# EAGLE design OneRCSchematic_v1_8 (EAGLE 8.2.2)
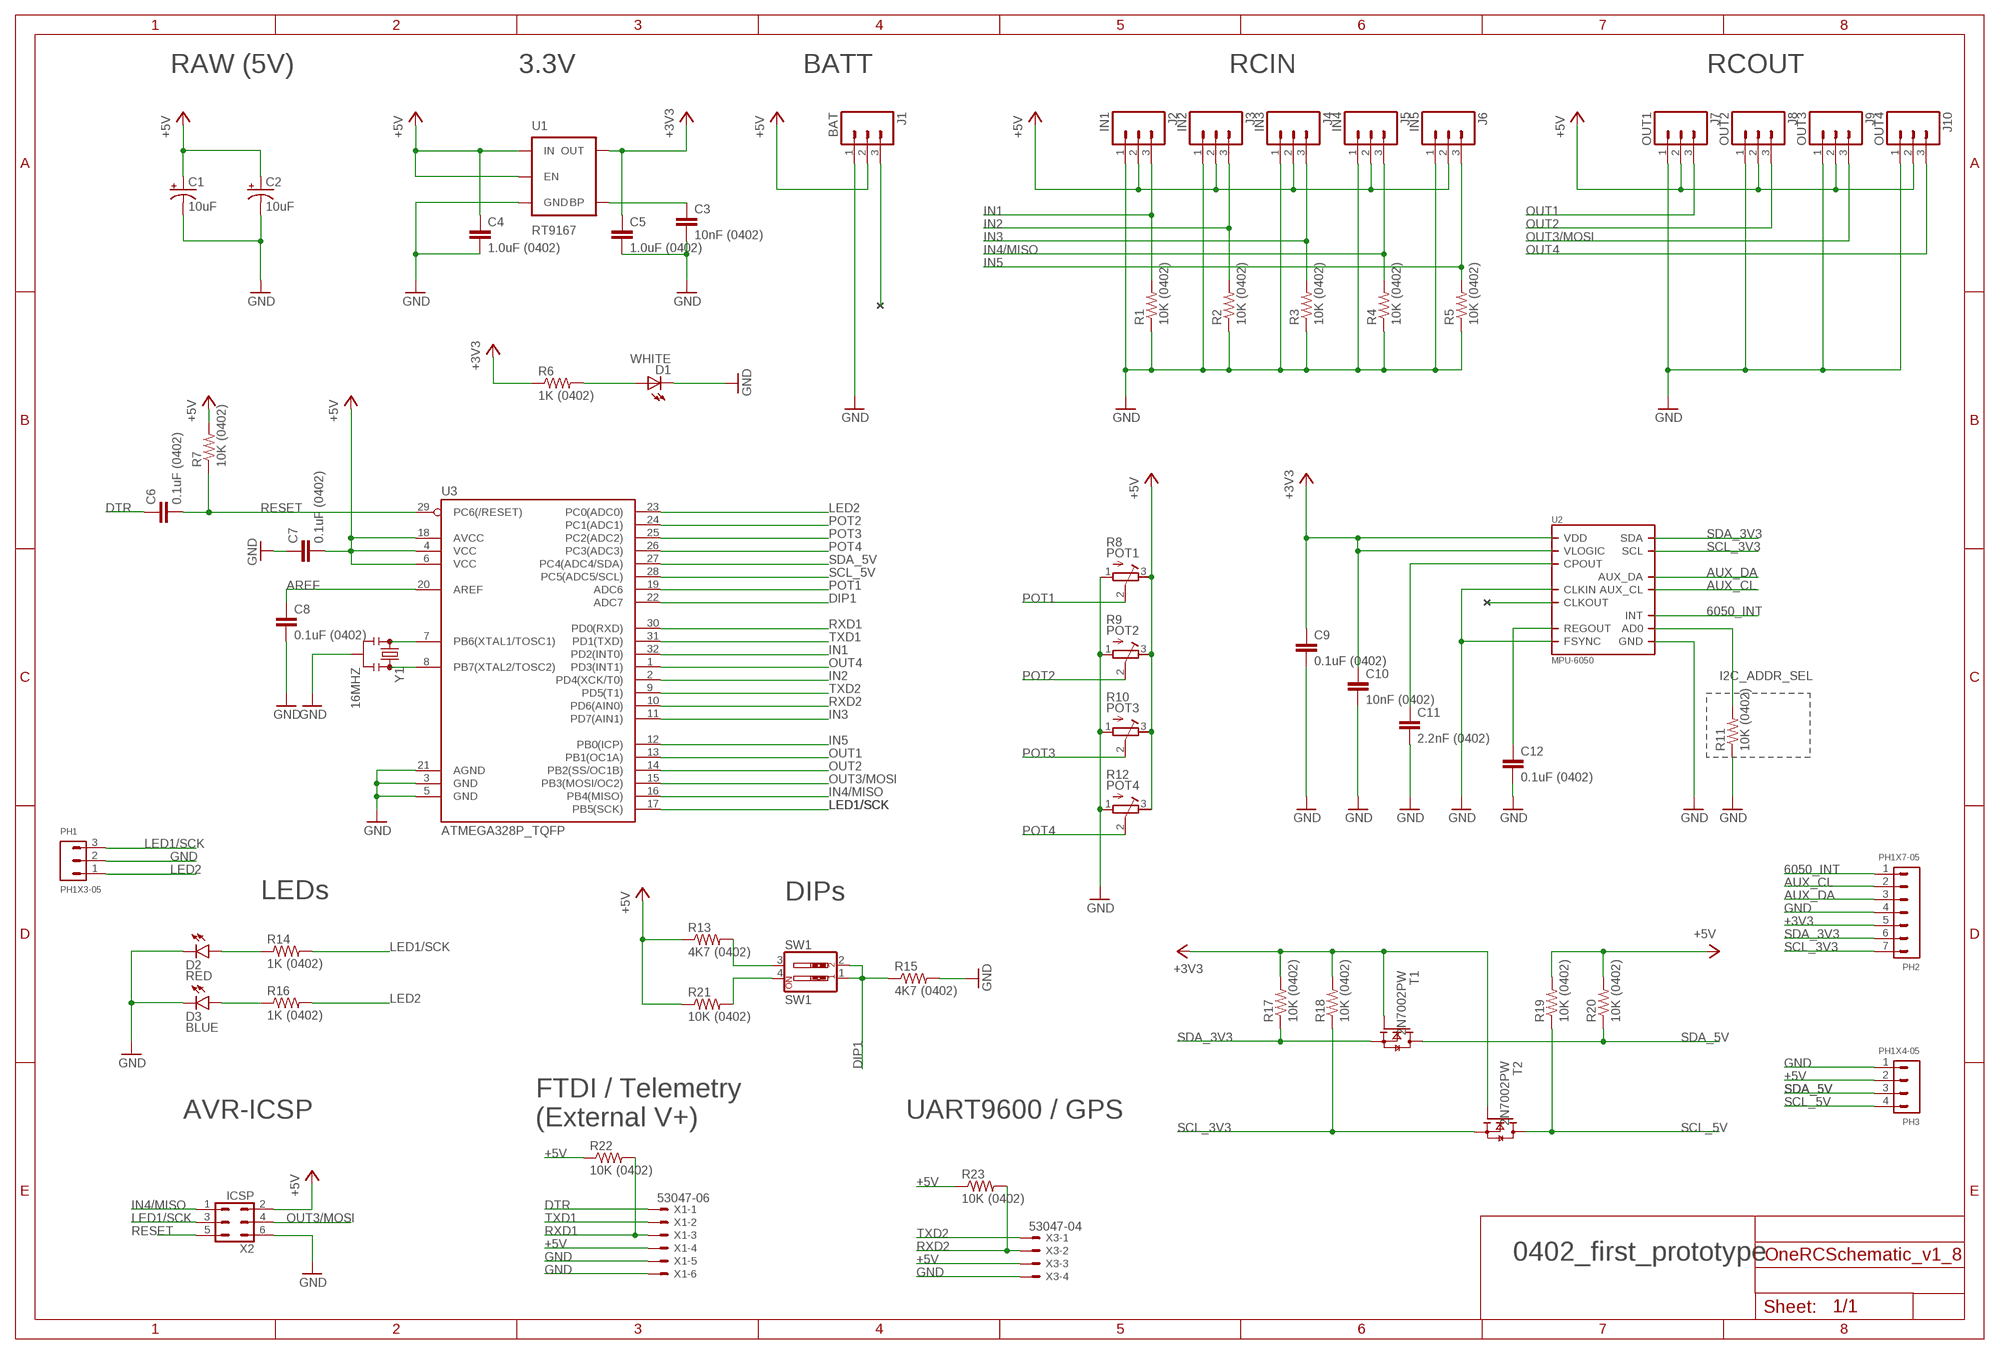
[diagram p0: schematic, sheet 1]

## Parts
C1  10uF  10UF-16V-10%(TANT)  [EIA3216]
C2  10uF  10UF-16V-10%(TANT)  [EIA3216]
C3  10nF (0402)  CAP0402-CAP  [0402-CAP]
C4  1.0uF (0402)  CAP0402-CAP  [0402-CAP]
C5  1.0uF (0402)  CAP0402-CAP  [0402-CAP]
C6  0.1uF (0402)  CAP0402-CAP  [0402-CAP]
C7  0.1uF (0402)  CAP0402-CAP  [0402-CAP]
C8  0.1uF (0402)  CAP0402-CAP  [0402-CAP]
C9  0.1uF (0402)  CAP0402-CAP  [0402-CAP]
C10  10nF (0402)  CAP0402-CAP  [0402-CAP]
C11  2.2nF (0402)  CAP0402-CAP  [0402-CAP]
C12  0.1uF (0402)  CAP0402-CAP  [0402-CAP]
D1  WHITE  LED-0402  [0402-LED]
D2  RED  LED-RED0603  [LED-0603]
D3  BLUE  LED-BLUE0603  [LED-0603]
J1  BAT  M03PTH  [1X03]
J2  IN1  M03PTH  [1X03]
J3  IN2  M03PTH  [1X03]
J4  IN3  M03PTH  [1X03]
J5  IN4  M03PTH  [1X03]
J6  IN5  M03PTH  [1X03]
J7  OUT1  M03PTH  [1X03]
J8  OUT2  M03PTH  [1X03]
J9  OUT3  M03PTH  [1X03]
J10  OUT4  M03PTH  [1X03]
PH1  PH1X3-05  [PH005-1-3]
PH2  PH1X7-05  [PH005-1-7]
PH3  PH1X4-05  [PH005-1-4]
R1  10K (0402)  RESISTOR0402  [0402-RES]
R2  10K (0402)  RESISTOR0402  [0402-RES]
R3  10K (0402)  RESISTOR0402  [0402-RES]
R4  10K (0402)  RESISTOR0402  [0402-RES]
R5  10K (0402)  RESISTOR0402  [0402-RES]
R6  1K (0402)  RESISTOR0402  [0402-RES]
R7  10K (0402)  RESISTOR0402  [0402-RES]
R8  POT1  R-TRIMM3202  [RTRIM3202]
R9  POT2  R-TRIMM3202  [RTRIM3202]
R10  POT3  R-TRIMM3202  [RTRIM3202]
R11  10K (0402)  RESISTOR0402  [0402-RES]
R12  POT4  R-TRIMM3202  [RTRIM3202]
R13  4K7 (0402)  RESISTOR0402  [0402-RES]
R14  1K (0402)  RESISTOR0402  [0402-RES]
R15  4K7 (0402)  RESISTOR0402  [0402-RES]
R16  1K (0402)  RESISTOR0402  [0402-RES]
R17  10K (0402)  RESISTOR0402  [0402-RES]
R18  10K (0402)  RESISTOR0402  [0402-RES]
R19  10K (0402)  RESISTOR0402  [0402-RES]
R20  10K (0402)  RESISTOR0402  [0402-RES]
R21  10K (0402)  RESISTOR0402  [0402-RES]
R22  10K (0402)  RESISTOR0402  [0402-RES]
R23  10K (0402)  RESISTOR0402  [0402-RES]
SW1  SW1  SW_DIP-2-SMT-HALFSIZE  [DIPSWITCH-02-50MIL]
T1  2N7002PW  [SOT323]
T2  2N7002PW  [SOT323]
U1  RT9167  MIC52053.3V  [SOT23-5]
U2  MPU-6050  [QFN.24.4X4]
U3  ATMEGA328P_TQFP  [TQFP32-08]
X1  53047-06  [53047-06]
X2  ICSP  PHB_1MM27_2X03_SNT  [PHB_1MM27_2X03_SNT]
X3  53047-04  [53047-04]
Y1  16MHZ  RESONATOR16MHZ  [RESONATOR-SMD]

## Nets
6050_INT: PH2.1 U2.12(INT)
+3V3: C5.1 C9.1 C10.1 PH2.5 R6.1 R17.2 R18.2 T1.1(G) T2.1(G) U1.5(OUT) U2.8(VLOGIC) U2.13(VDD)
+5V: C1.A(+) C2.A(+) C4.1 C7.2 J1.2 J2.2 J3.2 J4.2 J5.2 J6.2 J7.2 J8.2 J9.2 J10.2 PH3.2 R7.2 R8.3(E) R9.3(E) R10.3(E) R12.3(E) R13.1 R19.2 R20.2 R21.1 R22.1 R23.1 U1.1(IN) U1.3(EN) U3.4(VCC) U3.6(VCC) U3.18(AVCC) X1.4 X2.2 X3.3
AREF: C8.1 U3.20(AREF)
AUX_CL: PH2.2 U2.7(AUX_CL)
AUX_DA: PH2.3 U2.6(AUX_DA)
DIP1: R15.1 SW1.1 SW1.2 U3.22(ADC7)
DTR: C6.1 X1.1
GND: C1.C(-) C2.C(-) C3.2 C4.2 C5.2 C7.1 C8.2 C9.2 C10.2 C11.2 C12.2 D1.C D2.C D3.C J1.1 J2.1 J3.1 J4.1 J5.1 J6.1 J7.1 J8.1 J9.1 J10.1 PH1.2 PH2.4 PH3.1 R1.1 R2.1 R3.1 R4.1 R5.1 R8.1(A) R9.1(A) R10.1(A) R11.1 R12.1(A) R15.2 U1.2(GND) U2.1(CLKIN) U2.11(FSYNC) U2.18(GND) U3.3(GND) U3.5(GND) U3.21(AGND) X1.5 X1.6 X2.6 X3.4 Y1.2
IN1: J2.3 R1.2 U3.32(PD2(INT0))
IN2: J3.3 R2.2 U3.2(PD4(XCK/T0))
IN3: J4.3 R3.2 U3.11(PD7(AIN1))
IN4/MISO: J5.3 R4.2 U3.16(PB4(MISO)) X2.1
IN5: J6.3 R5.2 U3.12(PB0(ICP))
LED1/SCK: PH1.3 R14.2 U3.17(PB5(SCK)) X2.3
LED2: PH1.1 R16.2 U3.23(PC0(ADC0))
N$1: D2.A R14.1
N$2: U3.7(PB6(XTAL1/TOSC1)) Y1.1
N$3: U3.8(PB7(XTAL2/TOSC2)) Y1.3
N$4: J1.3
N$5: D3.A R16.1
N$6: D1.A R6.2
N$7: C3.1 U1.4(BP)
N$9: C11.1 U2.20(CPOUT)
N$10: C12.1 U2.10(REGOUT)
N$11: R13.2 SW1.3
N$12: R21.2 SW1.4
N$13: U2.22(CLKOUT)
N$15: R11.2 U2.9(AD0)
OUT1: J7.3 U3.13(PB1(OC1A))
OUT2: J8.3 U3.14(PB2(SS/OC1B))
OUT3/MOSI: J9.3 U3.15(PB3(MOSI/OC2)) X2.4
OUT4: J10.3 U3.1(PD3(INT1))
POT1: R8.2(S) U3.19(ADC6)
POT2: R9.2(S) U3.24(PC1(ADC1))
POT3: R10.2(S) U3.25(PC2(ADC2))
POT4: R12.2(S) U3.26(PC3(ADC3))
RESET: C6.2 R7.1 U3.29(PC6(/RESET)) X2.5
RXD1: R22.2 U3.30(PD0(RXD)) X1.3
RXD2: R23.2 U3.10(PD6(AIN0)) X3.2
SCL_3V3: PH2.7 R18.1 T2.2(S) U2.23(SCL)
SCL_5V: PH3.4 R19.1 T2.3(D) U3.28(PC5(ADC5/SCL))
SDA_3V3: PH2.6 R17.1 T1.2(S) U2.24(SDA)
SDA_5V: PH3.3 R20.1 T1.3(D) U3.27(PC4(ADC4/SDA))
TXD1: U3.31(PD1(TXD)) X1.2
TXD2: U3.9(PD5(T1)) X3.1

## Notes on the sheet
- RAW (5V) | 3.3V | BATT | RCIN | RCOUT
- I2C_ADDR_SEL
- LEDs | DIPs
- AVR-ICSP | UART9600 / GPS
- FTDI / Telemetry
  (External V+)
- 0402_first_prototype

## Library data of the parts
C1 C2 = SparkFun-Capacitors:10UF-16V-10%(TANT): CAP-00811 1206/EIA-3216 Tantalum capacitor; PROD_ID: CAP-00811
C3-C12 = SparkFun-Capacitors:CAP: Capacitor Standard 0603 ceramic capacitor, and 0.1" leaded capacitor.
D1 = pel_dipol_comp:LED
D2 = SparkFun-LED:LED-RED: Assorted Red LEDs LilyPad 1206- DIO-09912 1206- DIO-00809 0603- DIO-00819 "SMART" means more efficient and expensive; PROD_ID: DIO-00819
D3 = SparkFun-LED:LED-BLUE: Blue LEDs for production use Various blue LEDs stocked by SparkFun production 0603 - DIO-08575 Rebel - DIO-09553 1206 - DIO-09911; PROD_ID: DIO-08575
J1-J10 = SparkFun-Connectors:M03: Header 3 Standard 3-pin 0.1" header. Use with straight break away headers (SKU : PRT-00116), right angle break away headers (PRT-00553), swiss pins (PRT-00743), machine pins (PRT-00117), and female headers (PRT-00115). Molex polarized connector foot print use with SKU : PRT-08232 with associated crimp pins and housings.
PH1 = pel_hdr:PH1X3
PH2 = pel_hdr:PH1X7
PH3 = pel_hdr:PH1X4
R1-R7 R11 R13-R23 = SparkFun-Resistors:RESISTOR: Resistor Basic schematic elements and footprints for 0603, 1206, and PTH resistors.
R8-R10 R12 = resistor:R-TRIMM: Trimm resistor
SW1 = SparkFun-Electromechanical:SW_DIP-2: DIP SWITCH
T1 T2 = nxp_60:2N7002: N-channel TrenchMOS FET N-channel enhancement mode Field-Effect Transistor (FET) in a plastic package using TrenchMOS technology. AAL Eindhoven MK
U1 = SparkFun-PowerIC:MIC5205: MIC5205 150mA vreg 3.3V - VREG-00822 5V - VREG-00823; PROD_ID: VREG-00822
U2 = invensense:MPU-6050
U3 = SparkFun-DigitalIC:ATMEGA328P_TQFP; PROD_ID: IC-09069
X1 = con-molex:53?-06: CONNECTOR wire to board 1.25 mm (.049 inch) pitch header; MPN: 53047-0610-C; OC_FARNELL: 9733078; OC_NEWARK: 03M2965
X2 = _hhn_con_pinhead_box_1mm27_modify:PHB_1MM27_2X03_*: Pin Header Box-Type, 1.27mm/0.5"/50mil Pitch, 2x03 Circuits Note: see library description for an important note about THT-version
X3 = con-molex:53?-04: CONNECTOR wire to board 1.25 mm (.049 inch) pitch header; MF: WALDOM/MOLEX; MPN: 53047-0410; OC_FARNELL: 9733060; OC_NEWARK: 38C9900
Y1 = SparkFun-FreqCtrl:RESONATOR: Resonator Small SMD resonator. Used, eg, on the Arduino Pro/ Pro Mini boards. 8MHz- XTAL-08895 16MHz- XTAL-08900; PROD_ID: XTAL-08900

## Net classes
1 raw_1000mA_supply: width 1.016 mm

## Board
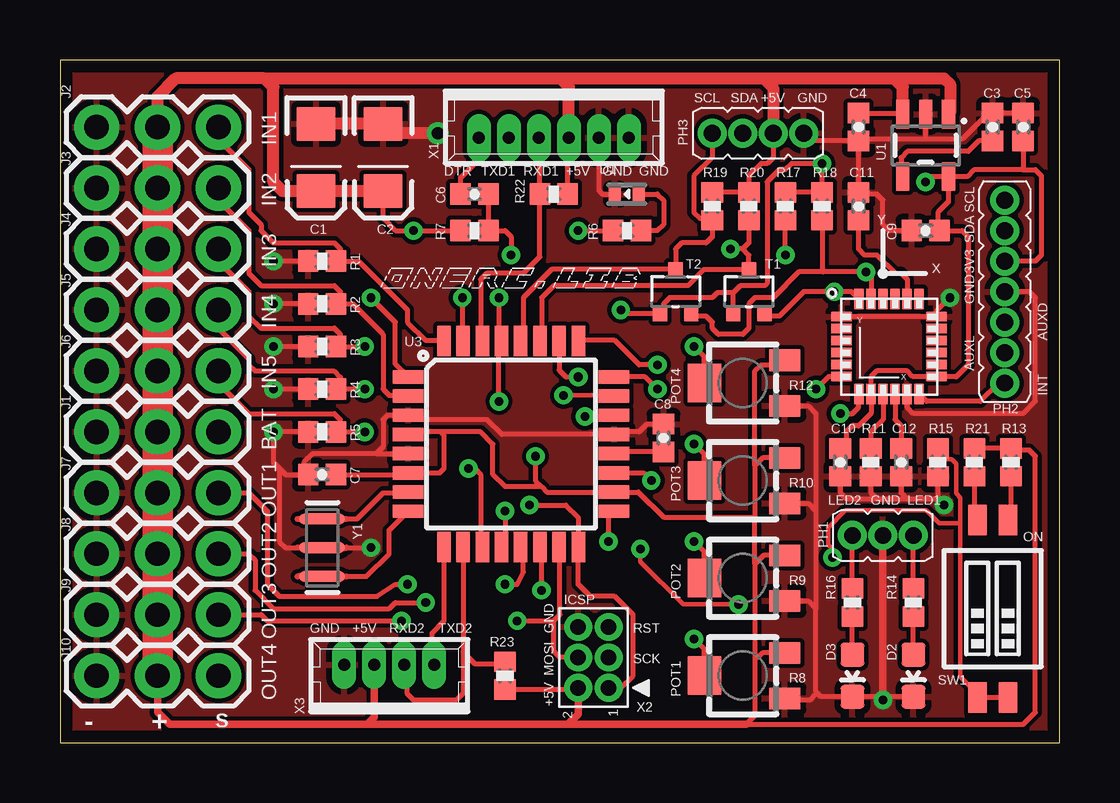
[diagram p1: board, top side]
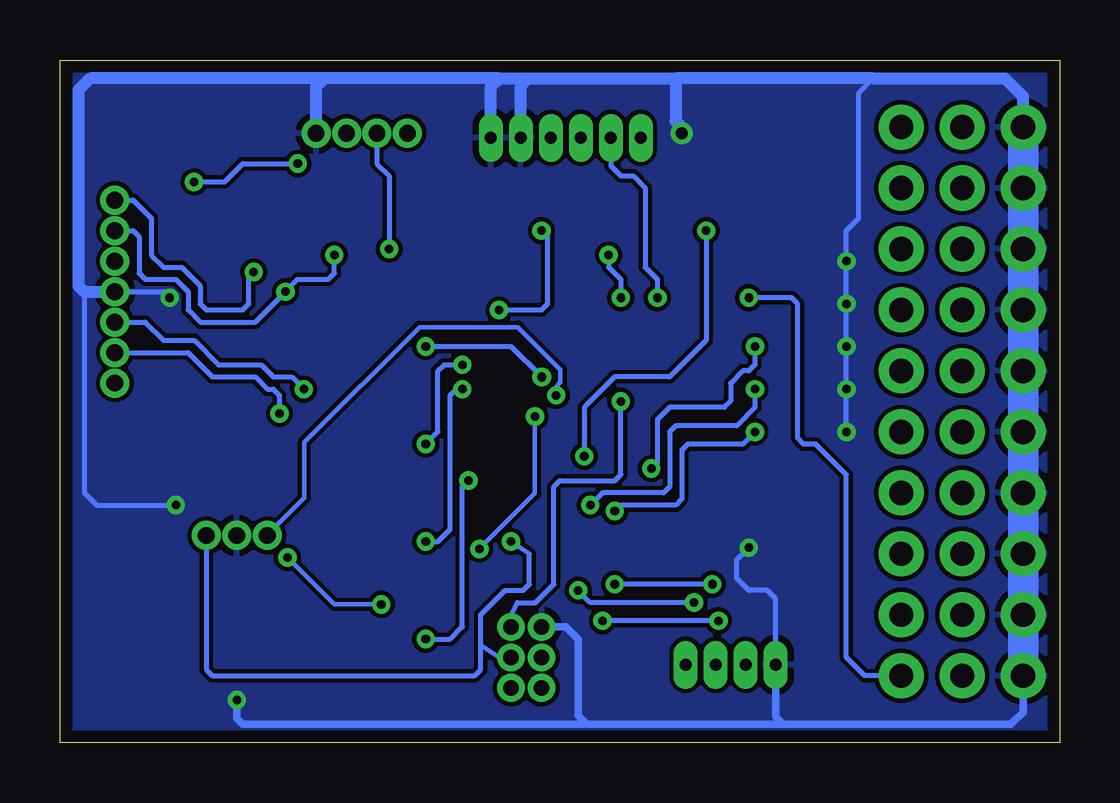
[diagram p2: board, bottom side, seen from below]

Size 41.66 x 28.45 mm. Coordinates in mm from the lower left corner, seen from the top.
Outline: 0,0 41.66,0 41.66,28.45 0,28.45 0,0
Copper layers (1*16): Top 0.035mm / dielectric 1.5mm / Bottom 0.035mm
Design rules "default *": minimum track width 7mil, minimum drill 14mil, track to track 7mil, track to pad 7mil, pad to pad 7mil, via to via 7mil, smd to smd 7mil, copper to edge 20mil, drill to drill 20mil, minimum pad ring 10mil, minimum via ring 8mil, stop-mask expansion 4mil, vias tented up to drill 0mil, thermal gap 10mil

### Footprints (pad centres in the part's own frame; a part is rotated, then mirrored left to right if it is on the bottom)
EIA3216 = smd 1.4 x 1.6: A 1.4,0; C -1.4,0
0402-CAP = smd 0.85 x 0.9: 1 -0.58,0; 2 0.58,0
0402-LED = smd 0.5 x 0.6: A 0.5,0; C -0.5,0
LED-0603 = smd 1 x 1: A 0,-0.877; C 0,0.877
1X03 = drill 1.016 pad 1.88: 1 0,0; 2 2.54,0; 3 5.08,0
PH005-1-3 = drill 0.7 pad 1.016: 1 0,0; 2 1.27,0; 3 2.54,0
PH005-1-7 = drill 0.7 pad 1.016: 1 0,0; 2 1.27,0; 3 2.54,0; 4 3.81,0; 5 5.08,0; 6 6.35,0; 7 7.62,0
PH005-1-4 = drill 0.7 pad 1.016: 1 0,0; 2 1.27,0; 3 2.54,0; 4 3.81,0
0402-RES = smd 0.85 x 0.9: 1 -0.58,0; 2 0.58,0
RTRIM3202 = smd 0.9 x 1.3: 1 -0.95,-1.75; 3 0.95,-1.75 | smd 1.6 x 1.4: 2 0,1.6
DIPSWITCH-02-50MIL = smd 0.762 x 1.27: 1 -0.635,-3.7; 2 0.635,-3.7; 3 0.635,3.7; 4 -0.635,3.7
SOT323 = smd 0.6 x 0.6: 1 -0.65,-0.925; 2 0.65,-0.925; 3 0,0.925
SOT23-5 = smd 0.55 x 1.2: 1 -0.95,-1.3; 2 0,-1.3; 3 0.95,-1.3; 4 0.95,1.3; 5 -0.95,1.3
QFN.24.4X4 = smd 0.85 x 0.38: 1 -1.975,1.25; 2 -1.975,0.75; 3 -1.975,0.25; 4 -1.975,-0.25; 5 -1.975,-0.75; 6 -1.975,-1.25; 13 1.975,-1.25; 14 1.975,-0.75; 15 1.975,-0.25; 16 1.975,0.25; 17 1.975,0.75; 18 1.975,1.25 | smd 0.38 x 0.85: 7 -1.25,-1.975; 8 -0.75,-1.975; 9 -0.25,-1.975; 10 0.25,-1.975; 11 0.75,-1.975; 12 1.25,-1.975; 19 1.25,1.975; 20 0.75,1.975; 21 0.25,1.975; 22 -0.25,1.975; 23 -0.75,1.975; 24 -1.25,1.975
TQFP32-08 = smd 1.27 x 0.559: 1 -4.293,2.8; 2 -4.293,2; 3 -4.293,1.2; 4 -4.293,0.4; 5 -4.293,-0.4; 6 -4.293,-1.2; 7 -4.293,-2; 8 -4.293,-2.8; 17 4.293,-2.8; 18 4.293,-2; 19 4.293,-1.2; 20 4.293,-0.4; 21 4.293,0.4; 22 4.293,1.2; 23 4.293,2; 24 4.293,2.8 | smd 0.559 x 1.27: 9 -2.8,-4.293; 10 -2,-4.293; 11 -1.2,-4.293; 12 -0.4,-4.293; 13 0.4,-4.293; 14 1.2,-4.293; 15 2,-4.293; 16 2.8,-4.293; 25 2.8,4.293; 26 2,4.293; 27 1.2,4.293; 28 0.4,4.293; 29 -0.4,4.293; 30 -1.2,4.293; 31 -2,4.293; 32 -2.8,4.293
53047-06 = drill 0.5 pad 0.698 long: 1 3.125,0.45; 2 1.875,0.45; 3 0.625,0.45; 4 -0.625,0.45; 5 -1.875,0.45; 6 -3.125,0.45
PHB_1MM27_2X03_SNT = drill 0.65: 1 -1.27,-0.635; 2 -1.27,0.635; 3 0,-0.635; 4 0,0.635; 5 1.27,-0.635; 6 1.27,0.635
53047-04 = drill 0.5 pad 0.698 long: 1 1.875,0.45; 2 0.625,0.45; 3 -0.625,0.45; 4 -1.875,0.45
RESONATOR-SMD = smd 0.45 x 1.905: 1 -1.2,0; 2 0,0; 3 1.2,0

### Placement (x,y rotation side)
C1  10.67,24.38 270 top
C2  13.46,24.38 270 top
C3  38.86,25.65 90 top
C4  33.27,25.65 270 top
C5  40.13,25.65 90 top
C6  17.27,22.86 0 top
C7  10.92,11.18 0 top
C8  25.15,12.7 90 top
C9  36.07,21.34 180 top
C10  32.51,11.68 270 top
C11  33.27,22.35 90 top
C12  35.05,11.68 270 top
D1  23.62,22.86 0 top
D2  35.56,2.79 180 top
D3  33.02,2.79 180 top
J1  1.52,12.95 0 top
J2  1.52,25.65 0 top
J3  1.52,23.11 0 top
J4  1.52,20.57 0 top
J5  1.52,18.03 0 top
J6  1.52,15.49 0 top
J7  1.52,10.41 0 top
J8  1.52,7.87 0 top
J9  1.52,5.33 0 top
J10  1.52,2.79 0 top
PH1  33.02,8.64 0 top
PH2  39.37,14.99 90 top
PH3  30.99,25.4 180 top
R1  10.92,20.07 0 top
R2  10.92,18.29 0 top
R3  10.92,16.51 0 top
R4  10.92,14.73 0 top
R5  10.92,12.95 0 top
R6  23.62,21.34 0 top
R7  17.27,21.34 180 top
R8  28.45,2.79 90 top
R9  28.45,6.86 90 top
R10  28.45,10.92 90 top
R11  33.78,11.68 90 top
R12  28.45,14.99 90 top
R13  39.62,11.68 270 top
R14  35.56,5.84 90 top
R15  36.58,11.68 270 top
R16  33.02,5.84 90 top
R17  30.23,22.35 90 top
R18  31.75,22.35 90 top
R19  27.18,22.35 90 top
R20  28.7,22.35 90 top
R21  38.1,11.68 270 top
R22  20.57,22.86 180 top
R23  18.54,2.79 90 top
SW1  38.86,5.59 0 top
T1  28.7,18.8 0 top
T2  25.65,18.8 0 top
U1  36.07,24.89 180 top
U2  34.54,16.51 0 top
U3  18.8,12.45 0 top
U$2  [ONE_RX_LOG_TINY_TOP]  13.21,18.8 0 top
X1  20.57,25.65 180 top
X2  22.23,3.56 90 top
X3  13.72,2.79 0 top
Y1  10.92,8.13 270 top

### Tracks (layer width: path | path; a pad name or v marks a point on that pad's centre or on a via)
6050_INT
  Top 0.203: PH2.1 39.12,14.99 38.35,14.22 36.1,14.22 U2.12
+3V3  (via drill 0.36 pad 0.51)
  Top 0.203: 28.21,18.03 T1.1 28.05,18.76 | 28.05,18.76 28.34,19.05 29.38,19.05 29.46,19.14 29.46,23.37 29.97,23.88 30.23,23.88 30.48,24.13 v31.75,24.13 R18.2 R17.2 | U1.5 37.82,23.59 38.1,23.88 40.1,23.88 | 40.1,23.88 40.64,23.88 40.89,23.62 40.89,20.32 40.64,20.07 PH2.5 | U1.5 36.29,23.59 v36.07,23.37 | C5.1 40.13,23.91 40.1,23.88 | v23.37,18.03 23.53,17.87 T2.1 25.15,18.01 25.15,18.29 25.4,18.54 27.18,18.54 27.39,18.76 28.05,18.76 | v21.59,21.34 R6.1 | U1.5 37.02,22.54 36.58,22.1 36.58,21.41 C9.1 37.59,21.34 37.85,21.08 37.85,15.75 37.34,15.24 36.54,15.24 U2.13 35.54,15.26 35.31,15.49 34.04,15.49 33.78,15.24 33.78,14.55 U2.8 33.79,13.73 33.27,13.21 33.02,13.21 32.77,12.95 32.77,12.52 C10.1
  Bottom 0.203: v23.37,18.03 21.59,18.03 21.34,18.29 21.34,21.08 v21.59,21.34 | v36.07,23.37 34.8,23.37 34.04,24.13 v31.75,24.13
+5V  (via drill 0.36 pad 0.51)
  Top 0.203: C7.2 14.43,11.18 U3.6 15.82,11.25 16,11.43 16,12.81 15.86,12.95 | R23.1 21.52,2.21 X2.2 | U3.4 14.61,12.95 15.86,12.95 | 39.41,12.26 R13.1 | 39.41,12.26 R21.1 | R19.2 R20.2 28.7,23.62 29.21,24.13 29.46,24.13 29.72,24.38 PH3.2 | 20.07,10.67 20.29,10.45 U3.18 24.1,10.45 25.15,9.4 28.91,9.4 28.96,9.35 | 20.07,10.67 18.54,10.67 18.03,11.18 18.03,12.45 17.53,12.95 15.86,12.95 | 28.96,3.43 28.96,1.12 28.6,0.76 40.13,0.76 40.64,1.27 40.64,11.94 40.39,12.19 39.48,12.19 39.41,12.26 | 28.96,7.45 28.96,3.43 | 28.96,7.45 28.96,9.35 | 30.13,7.62 R9.3 29.32,7.81 28.96,7.45 | 30.13,11.68 R10.3 29.28,11.87 28.96,11.55 | 28.96,11.55 28.96,9.35 | 28.96,11.55 28.96,15.49 29.21,15.75 30.13,15.75 R12.3 | C2.A 13.46,21.84 13.97,21.34 v14.73,21.34 R7.2 | v19.81,11.94 19.81,10.92 20.07,10.67 | C4.1 35.03,26.23 35.12,26.32 | R8.3 29.27,3.74 28.96,3.43 | R22.1 21.15,25.41 X1.4
  Top 0.305: 4.06,2.67 J10.2 4.06,1.27 4.57,0.76 12.79,0.76 | 12.79,0.76 21.16,0.76 | 21.16,0.76 28.6,0.76 | X2.2 21.59,1.19 21.16,0.76 | X3.3 13.09,1.06 12.79,0.76
  Top 0.508: J2.2 4.06,26.92 4.83,27.69 8.52,27.69 | 29.32,27.69 34.75,27.69 | 20.84,27.69 29.32,27.69 | 8.52,27.69 20.84,27.69 | 34.75,27.69 36.83,27.69 37.08,27.43 37.08,26.26 U1.1 | U1.3 35.12,26.32 35.12,27.32 34.75,27.69 | PH3.2 29.72,27.29 29.32,27.69 | X1.4 21.2,27.33 20.84,27.69 | 8.52,27.69 8.89,27.31 8.89,23.37 9.27,22.98 C1.A C2.A
  Top 1.27: J2.2 J3.2 J4.2 J5.2 J6.2 J1.2 J7.2 J8.2 J9.2 4.06,2.67
  Bottom 0.203: v14.73,21.34 14.73,16.76 16.26,15.24 18.54,15.24 19.81,13.97 v19.81,11.94
AREF
  Top 0.203: C8.1 23.16,12.12 U3.20
AUX_CL  (via drill 0.36 pad 0.51)
  Top 0.203: U2.7 33.27,14.51 33.27,13.97 33.02,13.72 v32.51,13.72
  Bottom 0.203: PH2.2 36.32,16.26 35.31,15.24 33.53,15.24 33.02,14.73 32.77,14.73 32.51,14.48 v32.51,13.72
AUX_DA  (via drill 0.36 pad 0.51)
  Top 0.203: U2.6 32.02,15.26 v31.5,14.73
  Bottom 0.203: PH2.3 38.1,17.53 37.34,16.76 36.07,16.76 35.05,15.75 33.27,15.75 32.77,15.24 32,15.24 v31.5,14.73
DIP1  (via drill 0.36)
  Top 0.178: 37.52,9.14 37.52,2.74 38.23,2.03 SW1.1 | 37.52,9.14 37.52,10.21 37.34,10.39 37.34,11.63 37.16,11.81 36.98,11.81 36.63,12.17 R15.1 | v21.87,13.59 22.94,13.59 U3.22 | v24.18,8.08 24.18,7.54 25.96,5.77 v28.27,5.77 | v32.18,7.72 32.18,8.08 32,8.25 32,8.97 32.72,9.68 36.09,9.68 36.63,9.14 37.52,9.14
  Top 0.203: SW1.1 SW1.2
  Bottom 0.178: v21.87,13.59 21.87,10.39 v24.18,8.08 | v28.27,5.77 30.23,5.77 v32.18,7.72
DTR
  Top 0.203: C6.1 16.69,23.55 17.27,24.13 17.27,25.03 X1.1
GND  (via drill 0.36 pad 0.51, 0.36 pad 0.56, 0.51 pad 0.81)
  Top 0.203: 13.18,12.05 U3.5 | 13.18,12.05 10.52,12.05 10.16,11.68 10.16,11.36 C7.1 9.4,11.18 9.14,11.43 | 13.18,12.05 13.46,12.33 13.46,13.46 13.65,13.65 U3.3 14.69,13.46 17.78,13.46 18.4,12.85 U3.21 23.2,12.95 24.13,12.95 24.46,13.28 C8.2 | C5.2 C3.2 38.68,26.23 37.59,25.15 36.07,25.15 | U2.18 36.54,17.78 | 33.27,25 33.2,25.07 | v37.08,18.54 36.52,17.98 U2.18 | U2.18 U2.1 | 30.67,5.65 R9.1 31.18,5.91 31.5,5.59 | 35.67,2.03 D2.C 34.43,1.92 v34.29,1.78 34.15,1.92 D3.C 31.7,1.92 31.5,2.12 | U2.11 35.31,14.52 35.31,13.97 35.56,13.72 40.13,13.72 40.64,14.22 40.64,18.54 40.39,18.8 PH2.4 | 36.83,10.85 R15.2 36.58,10.16 | v12.95,8.13 Y1.2 9.4,8.13 9.14,8.38 9.14,11.43 | R10.1 31.18,9.97 31.5,9.65 | 31.5,9.65 31.5,5.59 | R12.1 31.18,14.04 31.5,13.72 31.5,9.65 | R8.1 30.26,1.78 31.24,1.78 31.5,2.03 31.5,2.12 | 33.27,25 C11.2 33.35,22.86 34.04,22.86 34.29,22.61 34.29,21.59 34.54,21.34 C9.2 | C4.2 33.35,25.15 36.07,25.15 | 36.07,25.15 U1.2 | C4.2 31.31,25.07 PH3.1 | R1.1 v8.89,20.07 | R2.1 v8.89,18.29 | R3.1 v8.89,16.51 | R4.1 v8.89,14.73 | R5.1 v8.89,12.95 8.89,11.68 9.14,11.43 | 31.5,2.12 31.5,5.59 | C4.2 33.27,25 | C12.2 35.05,10.41 35.31,10.16 | 35.31,10.16 36.58,10.16 | 36.58,10.16 v36.83,9.91 | R11.1 33.78,10.41 34.04,10.16 | 34.04,10.16 35.31,10.16 | C10.2 32.51,10.41 32.77,10.16 34.04,10.16 | X1.5 22.45,23.02 22.61,22.86 D1.C
  Top 0.305: v34.29,1.78 PH1.2
  Top 0.508: C1.C C2.C 13.85,25.4 v15.75,25.4
  Bottom 0.203: 11.94,3.15 X3.4 11.84,6 12.19,6.35 12.95,6.35 13.46,6.86 13.46,7.62 v12.95,8.13 | PH2.4 37.34,18.8 v37.08,18.54 | v36.83,9.91 40.13,9.91 40.64,10.41 40.64,18.74 40.58,18.8 | v8.89,12.95 v8.89,14.73 v8.89,16.51 v8.89,18.29 v8.89,20.07 8.89,21.34 8.38,21.84 8.38,27.07 7.77,27.69
  Bottom 0.305: J10.1 1.52,1.27 2.03,0.76 11.53,0.76 | 11.53,0.76 19.71,0.76 | 19.71,0.76 34.04,0.76 34.29,1.02 v34.29,1.78 | X2.6 20.57,4.83 20.07,4.32 20.07,1.12 19.71,0.76 | X3.4 11.84,1.08 11.53,0.76
  Bottom 0.508: J2.1 1.52,26.92 2.29,27.69 7.77,27.69 16,27.69 | 23.36,27.69 22.14,27.69 | 23.36,27.69 30.63,27.69 | 22.14,27.69 16,27.69 | 30.63,27.69 40.39,27.69 40.89,27.18 40.89,19.05 40.64,18.8 40.58,18.8 PH2.4 | PH3.1 30.99,27.33 30.63,27.69 | X1.5 22.45,27.37 22.14,27.69 | X1.6 23.7,27.35 23.36,27.69 | 16,27.69 16,25.91 15.75,25.65 v15.75,25.4
  Bottom 1.27: J2.1 J3.1 J4.1 J5.1 J6.1 J1.1 J7.1 J8.1 J9.1 J10.1
  pour Bottom: 0,28.45 41.66,28.45 41.66,0 0,0
  pour Top: 0,28.45 0,0 41.66,0 41.66,28.45
IN1
  Top 0.203: J2.3 6.6,25.15 7.87,23.88 7.87,22.1 8.38,21.59 8.38,21.34 8.89,20.83 11.43,20.83 11.68,20.57 11.68,20.07 11.69,20.07 R1.2 12.45,20.07 14.48,18.03 14.48,17.53 15.24,16.76 15.97,16.76 U3.32
IN2
  Top 0.203: J3.3 6.6,22.61 7.87,21.34 7.87,19.56 8.38,19.05 11.43,19.05 11.68,18.8 11.68,18.32 11.71,18.29 | U3.2 14.47,14.48 13.72,14.48 13.46,14.73 13.46,17.02 12.19,18.29 11.71,18.29 | 11.71,18.29 R2.2
IN3  (via drill 0.36 pad 0.51)
  Top 0.203: J4.3 6.6,20.07 7.87,18.8 7.87,17.78 8.38,17.27 11.43,17.27 11.68,17.02 11.68,16.54 | 11.68,16.54 11.68,16.52 | U3.11 17.53,8.22 17.53,11.18 17.27,11.43 v17.02,11.43 | 11.71,16.51 v12.7,16.51 | 11.71,16.51 11.68,16.54 | R3.2 11.71,16.51
  Bottom 0.203: v12.7,16.51 12.7,15.75 12.95,15.49 13.21,15.49 13.72,14.99 13.72,14.22 13.97,13.97 16.26,13.97 16.76,13.46 16.76,11.68 v17.02,11.43
IN4/MISO  (via drill 0.36 pad 0.51)
  Top 0.203: U3.16 | 11.68,15.24 11.68,15.21 | 11.68,15.21 11.4,15.49 8.13,15.49 7.87,15.75 7.87,16 6.6,17.27 J5.3 | v19.56,9.91 21.08,9.91 21.59,9.4 U3.16 | X2.1 23.37,2.29 23.88,2.79 23.88,5.33 23.11,6.1 22.1,6.1 21.59,6.6 U3.16 | 11.68,15.21 11.68,14.91 R4.2 v12.7,14.73
  Bottom 0.203: v12.7,14.73 12.7,13.97 13.46,13.21 16,13.21 16.26,12.95 16.26,10.67 16.51,10.41 19.05,10.41 v19.56,9.91
IN5  (via drill 0.36 pad 0.51)
  Top 0.203: 11.6,12.95 v12.7,12.95 | J6.3 6.6,14.99 7.87,13.72 11.43,13.72 11.68,13.46 11.68,13.04 11.6,12.95 | U3.12 18.29,8.26 18.54,8.51 v18.54,9.65 | R5.2 11.6,12.95
  Bottom 0.203: v12.7,12.95 13.21,12.45 15.49,12.45 15.75,12.19 15.75,10.16 16,9.91 18.29,9.91 v18.54,9.65
LED1/SCK  (via drill 0.36 pad 0.51)
  Top 0.203: v22.86,8.38 22.86,9.42 U3.17 | R14.2 PH1.3
  Bottom 0.203: X2.3 23.37,3.56 24.13,4.06 | 24.13,4.06 24.13,5.33 23.11,6.35 22.35,6.35 22.1,6.6 22.1,7.87 v22.86,8.38 | PH1.3 35.56,3.05 35.31,2.79 24.38,2.79 24.13,3.05 24.13,4.06
LED2  (via drill 0.36)
  Top 0.178: 22.94,14.3 U3.23 22.94,14.48 v20.98,14.48
  Top 0.203: R16.2 PH1.1
  Bottom 0.178: v20.98,14.48 20.98,14.83 20.8,15.01 20.8,15.54 22.58,17.32 26.67,17.32 31.47,12.52 31.47,10.21 32.89,8.79 PH1.1
N$1
  Top 0.203: D2.A R14.1
N$2
  Top 0.203: Y1.1 12.38,9.33 13.46,10.41 14.47,10.41 U3.7
N$3
  Top 0.203: Y1.3 12.77,6.93 13.72,7.87 13.72,8.86 U3.8
N$5
  Top 0.203: D3.A R16.1
N$6
  Top 0.203: D1.A 24.89,22.86 25.15,22.61 25.15,21.59 24.89,21.34 R6.2
N$7
  Top 0.203: C3.1 38.28,25.07 37.85,24.64 35.31,24.64 35.05,24.38 35.05,23.66 U1.4
N$9
  Top 0.203: C11.1 33.27,20.57 33.53,20.32 34.04,20.32 34.8,19.56 35.05,19.56 35.31,19.3 35.31,18.5 U2.20
N$10
  Top 0.203: U2.10 34.79,13.47 35.05,13.21 C12.1
N$11
  Top 0.203: R13.2 39.62,9.41 SW1.3
N$12
  Top 0.203: R21.2 38.1,9.41 SW1.4
N$15
  Top 0.203: U2.9 34.29,13.47 33.78,12.95 R11.2
OUT1  (via drill 0.36 pad 0.51)
  Top 0.203: J7.3 7.87,10.41 8.64,9.65 8.64,6.6 9.14,6.1 13.21,6.1 13.97,6.6 v14.48,6.6 | v18.54,6.6 19.05,6.6 19.3,7.11 19.3,8.04 U3.13
  Bottom 0.203: v14.48,6.6 v18.54,6.6
OUT2  (via drill 0.36 pad 0.51)
  Top 0.203: J8.3 7.87,7.87 8.13,7.62 8.13,6.35 8.89,5.59 13.72,5.59 13.97,5.84 v15.24,5.84 | v20.07,6.35 20.07,8.08 U3.14
  Bottom 0.203: v15.24,5.84 19.56,5.84 v20.07,6.35
OUT3/MOSI  (via drill 0.36 pad 0.51)
  Top 0.203: X2.4 20.83,3.56 20.57,3.81 20.57,5.08 | U3.15 20.83,8.12 20.83,5.33 20.57,5.08 | J9.3 8.38,5.33 8.64,5.08 v14.22,5.08 | v19.05,5.08 20.57,5.08
  Bottom 0.203: v14.22,5.08 v19.05,5.08
OUT4  (via drill 0.36 pad 0.51)
  Top 0.203: U3.1 13.97,15.78 13.97,17.53 v12.95,18.54
  Bottom 0.203: J10.3 8.13,2.79 8.89,3.56 8.89,11.18 10.16,12.45 10.67,12.45 10.92,12.7 10.92,18.29 11.18,18.54 v12.95,18.54
POT1  (via drill 0.36 pad 0.51)
  Top 0.203: R8.2 26.85,3.89 v26.42,4.32 | U3.19 24.31,11.25 v24.64,10.92
  Bottom 0.203: v26.42,4.32 25.4,4.32 24.89,4.83 24.89,10.67 v24.64,10.92
POT2  (via drill 0.36 pad 0.51)
  Top 0.203: R9.2 26.85,7.95 v26.42,8.38 | v24.89,14.73 24.38,15.24 U3.24
  Bottom 0.203: v26.42,8.38 25.91,8.38 25.4,8.89 25.4,14.48 25.15,14.73 v24.89,14.73
POT3  (via drill 0.36 pad 0.51)
  Top 0.203: R10.2 26.85,12.01 v26.42,12.45 | U3.25 21.62,16.76 23.11,16.76 24.13,15.75 v24.89,15.75
  Bottom 0.203: v26.42,12.45 25.91,12.95 25.91,15.49 25.65,15.75 v24.89,15.75
POT4  (via drill 0.36 pad 0.51, 0.38 pad 0.64)
  Top 0.203: R12.2 26.85,16.08 v26.42,16.51 | 20.83,16.71 U3.26 20.8,15.53 21.08,15.24 v21.59,15.24
  Bottom 0.203: v26.42,16.51 22.86,16.51 v21.59,15.24
RESET  (via drill 0.36 pad 0.51)
  Top 0.203: v18.29,14.22 18.29,16.63 U3.29 18.29,16.85 v18.29,18.54 | C6.2 R7.1 18.54,21.34 18.8,21.08 v18.8,20.32
  Bottom 0.203: X2.5 22.86,5.33 22.61,5.84 21.84,5.84 21.08,6.6 21.08,10.67 20.83,10.92 18.54,10.92 18.29,11.18 v18.29,14.22 | v18.8,20.32 18.8,19.81 18.29,19.3 v18.29,18.54
RXD1
  Top 0.203: U3.30 17.53,16.81 17.53,19.3 17.78,19.56 19.3,19.56 19.99,20.25 R22.2 19.99,25.16 X1.3
RXD2
  Top 0.203: U3.10 16.8,3.78 | 16.8,3.78 17.27,3.3 18.47,3.3 R23.2 | 16.8,3.78 16.8,2.06 16.51,1.78 14.73,1.78 14.48,2.03 14.48,3.11 X3.2
SCL_3V3  (via drill 0.36 pad 0.51)
  Top 0.203: 31.8,19.62 v33.59,19.62 33.79,19.41 U2.23 | T2.2 26.39,17.78 26.92,17.78 27.18,17.53 27.18,17.27 27.43,17.02 28.45,17.02 28.7,17.27 28.7,18.29 28.96,18.54 29.72,18.54 30.79,19.62 31.8,19.62 | R18.1 31.75,19.66 31.8,19.62
  Bottom 0.203: PH2.7 38.61,22.61 37.85,21.84 37.85,20.32 37.34,19.81 36.58,19.81 35.81,19.05 35.81,18.29 35.56,18.03 34.04,18.03 33.78,18.29 33.78,19.42 v33.59,19.62
SCL_5V
  Top 0.203: PH3.4 27.18,24.38 26.42,23.62 26.42,22.1 26.67,21.84 27.08,21.84 27.18,21.74 R19.1 27.18,21.08 26.92,20.83 25.91,20.83 25.65,20.57 T2.3 20.48,19.72 19.3,18.54 19.3,16.85 U3.28
SDA_3V3  (via drill 0.36 pad 0.51)
  Top 0.203: U2.24 32.98,18.8 v32.26,18.8 30.99,18.8 29.97,17.78 29.44,17.78 T1.2 | v30.23,20.32 R17.1
  Bottom 0.203: PH2.6 38.61,21.34 38.35,21.08 38.35,19.56 38.1,19.3 36.83,19.3 36.32,18.8 36.32,18.03 35.81,17.53 33.53,17.53 v32.26,18.8 31.75,19.3 30.48,19.3 30.23,19.56 v30.23,20.32
SDA_5V  (via drill 0.36 pad 0.51)
  Top 0.203: U3.27 20.07,16.81 20.07,18.54 20.57,19.05 26.16,19.05 26.83,19.72 T1.3 28.7,20.32 28.45,20.57 | R20.1 28.7,20.83 28.45,20.57 | 28.45,20.57 v27.94,20.57
  Bottom 0.203: PH3.3 28.45,24.13 27.94,23.62 v27.94,20.57
TXD1  (via drill 0.36 pad 0.51)
  Top 0.203: v16.76,18.54 16.76,16.77 U3.31
  Bottom 0.203: X1.2 18.7,24.03 18.29,23.62 17.78,23.62 17.27,23.11 17.27,19.81 16.76,19.3 v16.76,18.54
TXD2
  Top 0.203: U3.9 16,5.07 15.49,4.57 15.49,3.34 X3.1

### Text on the board
tPlace: SCL | SDA | +5V | GND | DTR | TXD1 | RXD1 | +5V | GND | GND | SCL | Y | SDA | X | 3V3 | GND | AUXD | AUXL | INT | LED2 | GND | LED1 | ON | GND | +5V | RXD2 | TXD2 | GND | RST | MOSI | SCK | +5V | - | + | S